# EAGLE schematic BabyBotHarnessPCB (EAGLE 6.4)
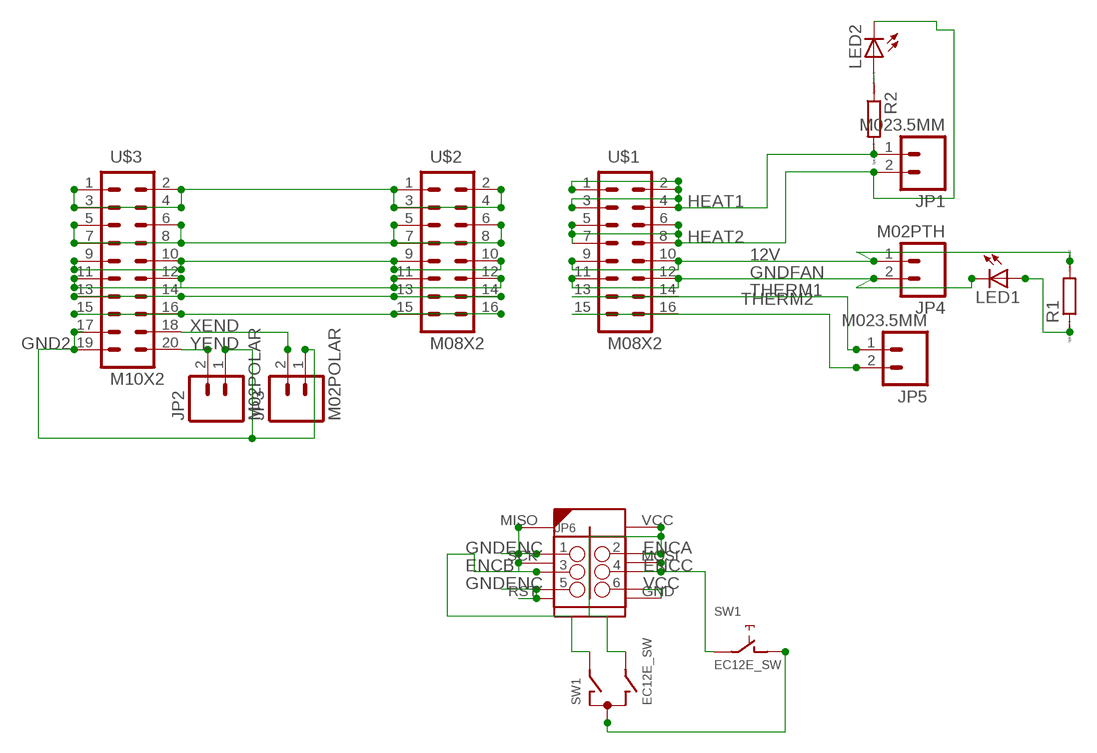
[diagram p0: schematic, sheet 1]

## Parts
JP1  M023.5MM  [SCREWTERMINAL-3.5MM-2]
JP2  M02POLAR  [MOLEX-1X2]
JP3  M02POLAR  [MOLEX-1X2]
JP4  M02PTH  [1X02]
JP5  M023.5MM  [SCREWTERMINAL-3.5MM-2]
JP6  M03X2SHROUD  [2X3-SHROUDED]
LED1  LED5MM  [LED5MM]
LED2  LEDCHIPLED_1206  [CHIPLED_1206]
R1  RR1206  [R1206]
R2  RR1206  [R1206]
SW1  EC12E_SW  [ALPS_EC12E_SW]
U$1  M08X2  [2X8]
U$2  M08X2  [2X8]
U$3  M10X2  [2X10]
U$4  AVR-ISP-6-EDGE  [6PAD_ISP]

## Nets
12V: JP4.1 R1.2 U$1.9 U$1.10
ENCA: JP6.2 SW1.B U$4.VCC
ENCB: JP6.3 SW1.A U$4.SCK
ENCC: JP6.4 SW1.E U$4.MOSI
GND2: JP2.1 JP3.1 U$3.17 U$3.19
GNDENC: JP6.1 JP6.5 SW1.C SW1.D U$4.MISO U$4.RST
GNDFAN: JP4.2 LED1.K(C) U$1.11 U$1.12
GNDFAN2: U$2.9 U$2.10 U$3.9 U$3.10
HEAT1: JP1.1 R2.2 U$1.1 U$1.2 U$1.3 U$1.4
HEAT2: JP1.2 LED2.C U$1.5 U$1.6 U$1.7 U$1.8
N$1: U$2.1 U$2.2 U$2.3 U$2.4 U$3.1 U$3.2 U$3.3 U$3.4
N$2: U$2.5 U$2.6 U$2.7 U$2.8 U$3.5 U$3.6 U$3.7 U$3.8
N$5: U$2.11 U$2.12 U$3.11 U$3.12
N$6: LED2.A R2.1
N$7: LED1.A R1.1
N$8: U$2.13 U$2.14 U$3.13 U$3.14
N$9: U$2.15 U$2.16 U$3.15 U$3.16
THERM1: JP5.1 U$1.13 U$1.14
THERM2: JP5.2 U$1.15 U$1.16
VCC: JP6.6 U$4.GND
XEND: JP3.2 U$3.18
YEND: JP2.2 U$3.20
Unconnected: SW1.GND1(G) SW1.GND2(G)

## Library data of the parts
JP1-JP5 = SparkFun-Connectors:M02: Standard 2-pin 0.1" header. Use with - straight break away headers ( PRT-00116) - right angle break away headers (PRT-00553) - swiss pins (PRT-00743) - machine pins (PRT-00117) - female headers (PRT-00115) Molex polarized connector foot print use with: PRT-08233 with associated crimp pins and housings. 2.54_SCREWTERM for use with PRT-10571. 3.5mm Screw Terminal footprints for PRT-08084 5mm Screw Terminal footprints for use with PRT-08432
JP6 = SparkFun-Connectors:M03X2: 2x3 .1" header. Shrouded, with keying- CONN-10681 SMT- CONN-11415 Pogo pins- HW-11044; PROD_ID: CONN-10681
LED1 LED2 = adafruit:LED: LED OSRAM: - CHIPLED LG R971, LG N971, LY N971, LG Q971, LY Q971, LO R971, LY R971 LH N974, LH R974 LS Q976, LO Q976, LY Q976 LO Q996 - Hyper CHIPLED LW Q18S LB Q993, LB Q99A, LB R99A - SideLED LS A670, LO A670, LY A670, LG A670, LP A670 LB A673, LV A673, LT A673, LW A673 LH A674 LY A675 LS A676, LA A676, LO A676, LY A676, LW A676 LS A679, LY A679, LG A679 - Hyper Micro SIDELED® LS Y876, LA Y876, LO Y876, LY Y876 LT Y87S - SmartLED LW L88C, LW L88S LB L89C, LB L89S, LG L890 LS L89K, LO L89K, LY L89K LS L896, LA L896, LO L896, LY L896 - TOPLED LS T670, LO T670, LY T670, LG T670, LP T670 LSG T670, LSP T670, LSY T670, LOP T670, LYG T670 LG T671, LOG T671, LSG T671 LB T673, LV T673, LT T673, LW T673 LH T674 LS T676, LA T676, LO T676, LY T676, LB T676, LH T676, LSB T676, LW T676 LB T67C, LV T67C, LT T67C, LS T67K, LO T67K, LY T67K, LW E67C LS E67B, LA E67B, LO E67B, LY E67B, LB E67C, LV E67C, LT E67C LW T67C LS T679, LY T679, LG T679 LS T770, LO T770, LY T770, LG T770, LP T770 LB T773, LV T773, LT T773, LW T773 LH T774 LS E675, LA E675, LY E675, LS T675 LS T776, LA T776, LO T776, LY T776, LB T776 LHGB T686 LT T68C, LB T68C - Hyper Mini TOPLED® LB M676 - Mini TOPLED Santana® LG M470 LS M47K, LO M47K, LY M47K Source: http://www.osram.convergy.de/
R1 R2 = eagle-ltspice:R: RESISTOR, European symbol; SPICEMODEL: NONE; SPICEPREFIX: R
SW1 = switch-alps:EC12E_SW: ALPS rotary Encoder EC12E series with switch; MPN: EC12E2424407; OC_FARNELL: 1520813; OC_NEWARK: 74M1068
U$1 U$2 = SparkFun-Connectors:M08X2: .1" headers, two rows of 8 each
U$3 = SparkFun-Connectors:M10X2: This was SPECIALLY designed to be used with our Graphic LCD Backpack. Be sure you want to use this! It is not only staggered on each line of header holes, but IT IS ALSO offset of the center point of the top and bottom lines by 5 mil. This causes the headers to lock into place on the "standard" footprint on the LCD screen. The extra squares on the tdocu layer are there simply to reference other pins (if you were to actually populate a longer header than ten long - this is what we do with the backpacks).
U$4 = atmega-atxmega:AVR-ISP-6-EDGE: 6 pin edge connector for ISP with ATMEL MCUs. Developed by Craig Moates (craig at moates dot net). Library by David Blundell (blundar at gmail dot com). Often, even a 6 pin header is really inconvenient for board layout and/or production. This SMD-only header is our de-facto standard for using an edge connector for programming with the help of a 6pin/10pin to edge card adapter.